# EAGLE design LampMatrixShield (EAGLE 7.2.0)
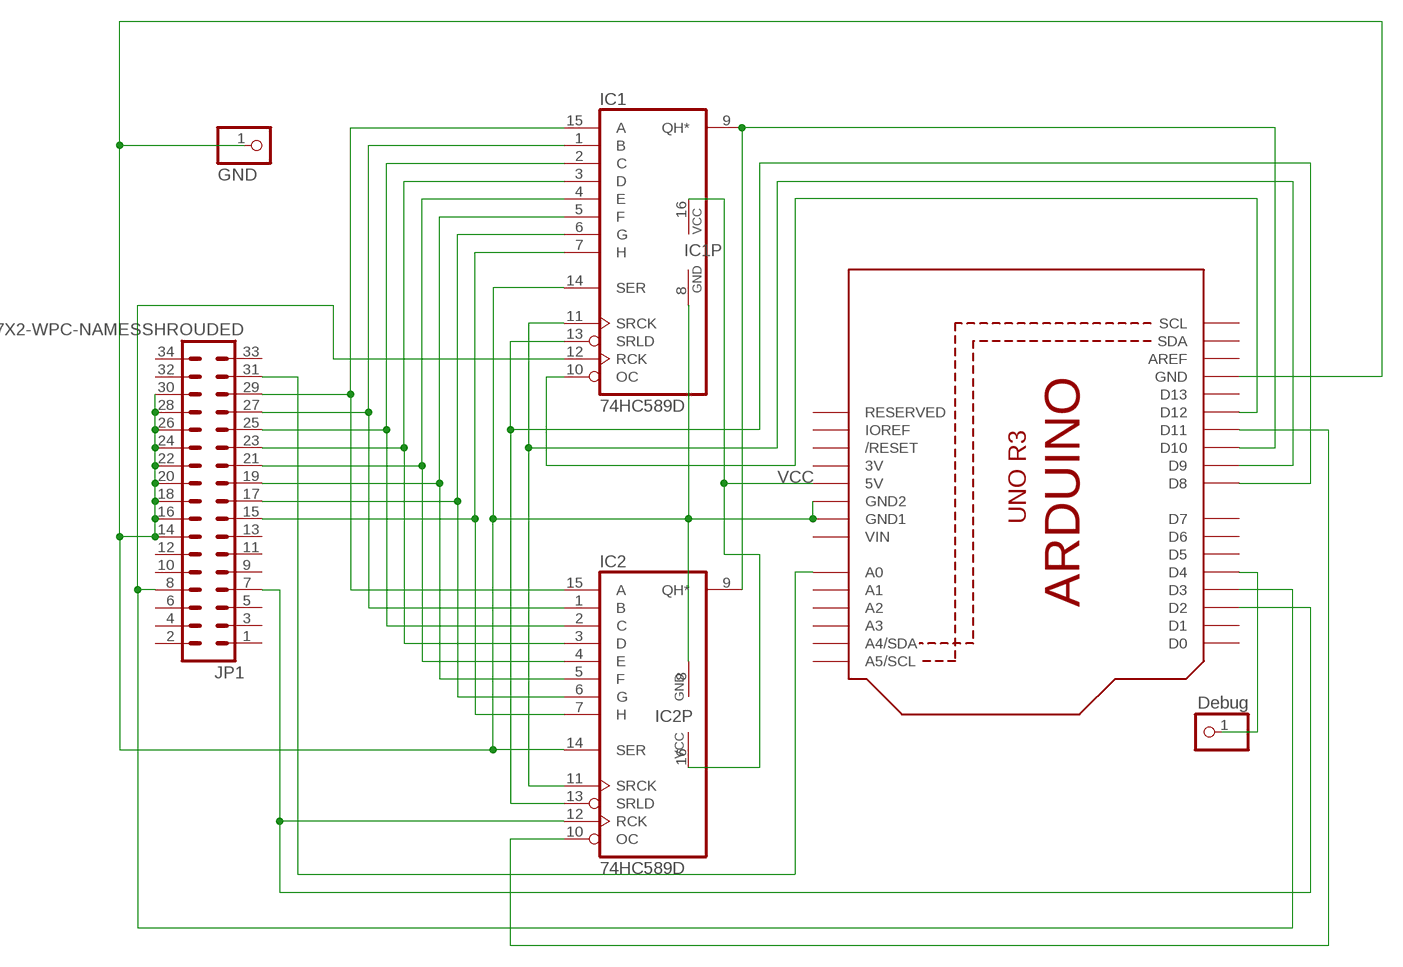
[diagram p0: schematic, sheet 1]

## Parts
IC1  74HC589D  [SO16]
IC2  74HC589D  [SO16]
JP1  M17X2-WPC-NAMESSHROUDED  [2X17_SHROUDED]
JP2  GND  PINHD-1X1CB  [1X01-CLEANBIG]
JP3  Debug  PINHD-1X1CB  [1X01-CLEANBIG]
U1  ARDUINOR3-BPLACE  [ARDUINOR3-BPLACE]

## Nets
GND: IC1.8(GND) IC1.14(SER) IC2.8(GND) IC2.14(SER) JP1.14 JP1.16 JP1.18 JP1.20 JP1.22 JP1.24 JP1.26 JP1.28 JP1.30 JP2.1 U1.GND U1.GND1 U1.GND2
N$1: IC1.15(A) IC2.15(A) JP1.29
N$2: IC1.1(B) IC2.1(B) JP1.27
N$3: IC1.2(C) IC2.2(C) JP1.25
N$4: IC1.3(D) IC2.3(D) JP1.23
N$5: IC1.4(E) IC2.4(E) JP1.21
N$6: IC1.5(F) IC2.5(F) JP1.19
N$7: IC1.6(G) IC2.6(G) JP1.17
N$8: IC1.7(H) IC2.7(H) JP1.15
N$9: IC2.12(RCK) JP1.7 U1.D2
N$10: IC1.12(RCK) JP1.8 U1.D3
N$11: JP1.31 U1.A0
N$12: IC2.10(OC) U1.D11
N$13: IC1.10(OC) U1.D12
N$14: IC1.13(SRLD) IC2.13(SRLD) U1.D8
N$15: IC1.11(SRCK) IC2.11(SRCK) U1.D9
N$16: JP3.1 U1.D4
N$25: IC1.9(QH*) IC2.9(QH*) U1.D10
VCC: IC1.16(VCC) IC2.16(VCC) U1.5V
Unconnected: JP1.1 JP1.2 JP1.3 JP1.4 JP1.5 JP1.6 JP1.9 JP1.10 JP1.11 JP1.12 JP1.13 JP1.32 JP1.33 JP1.34 U1.A1 U1.A2 U1.A3 U1.A4(A4/SDA) U1.A5(A5/SCL) U1.AREF U1.D0 U1.D1 U1.D5 U1.D6 U1.D7 U1.D13 U1.IOREF U1.RESERVED U1.RESET(/RESET) U1.SCL U1.SDA

## Power pins joined to a net without a drawn wire
3V: U1.3V
VIN: U1.VIN

## Library data of the parts
IC1 IC2 = EricGu:74*589: 8-bit SHIFT REGISTER, input latch, 3-state
JP1 = EricGu:M17X2-WPC-NAMES: 0.1" spaced headers; PROD_ID: CONN-12263
JP2 JP3 = adafruit:PINHD-1X1: Pin header 1x1 for 0.1" spacing With round pins
U1 = adafruit:ARDUINOR3: This is a new object for the new Arduino R3 - with extra pins that you may want to use (such as IOref, and duplicated A4/A5

## Board
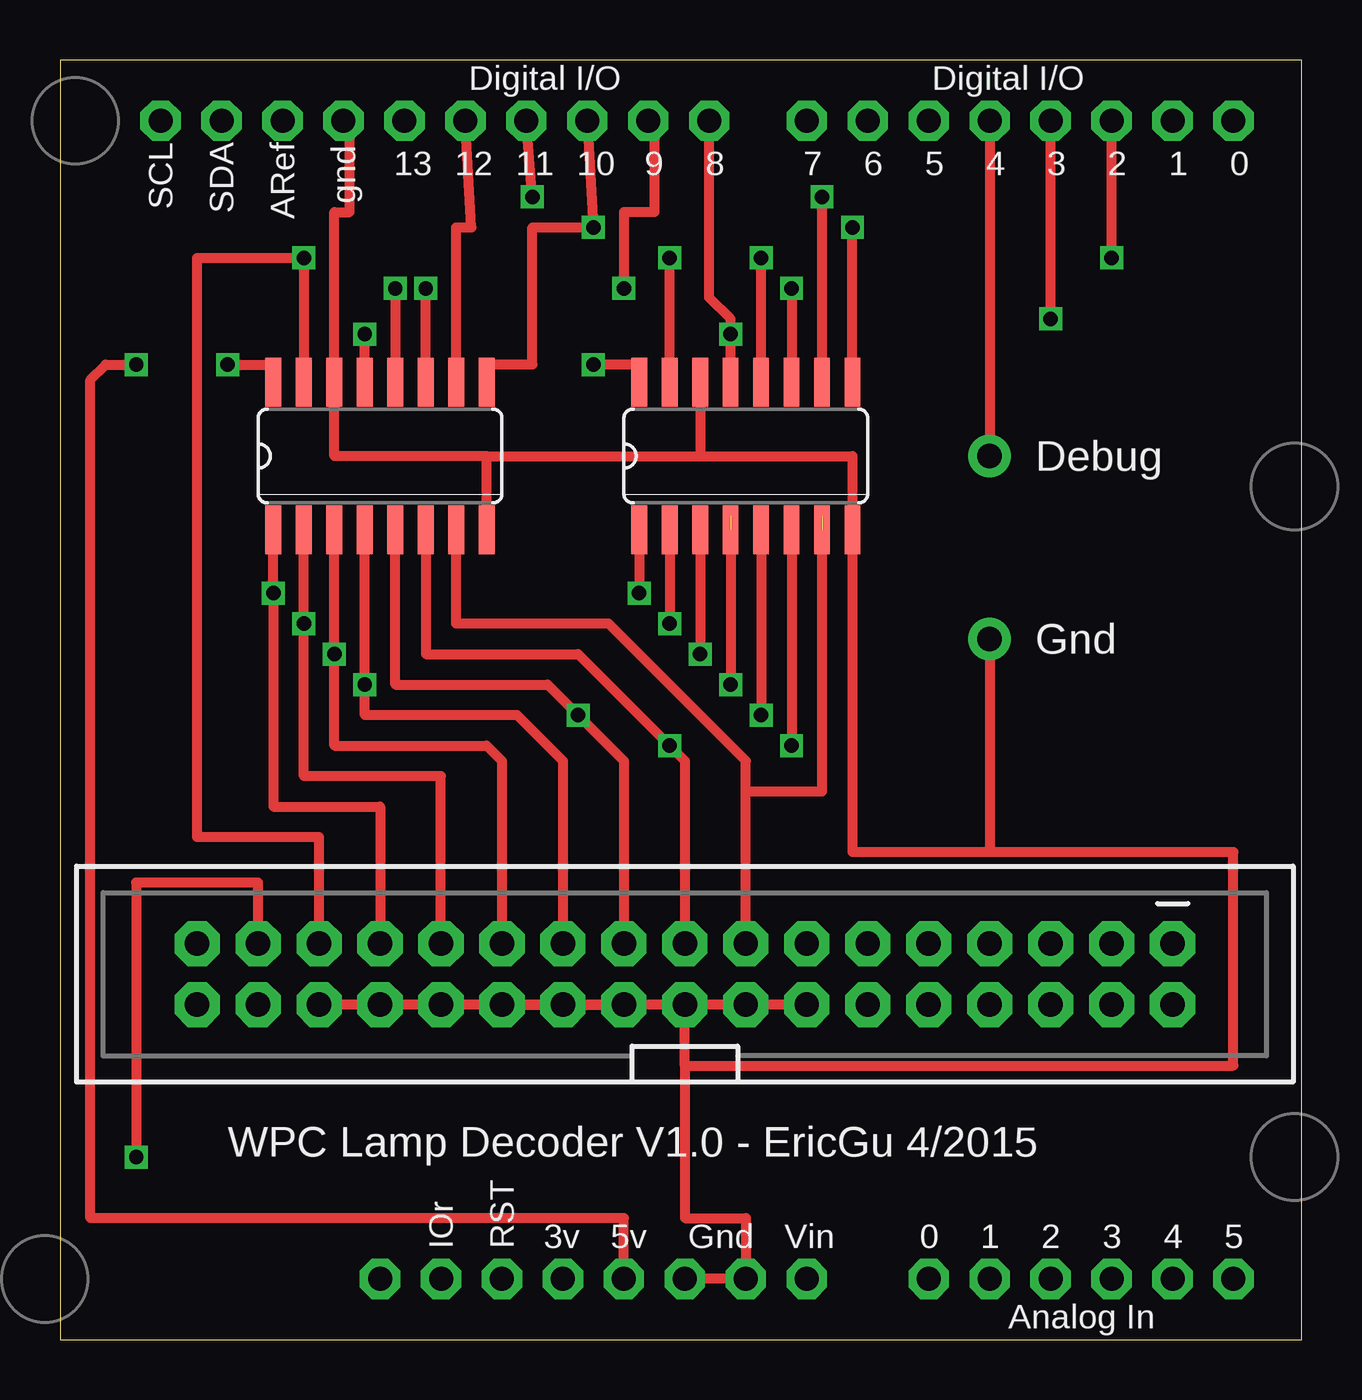
[diagram p1: board, top side]
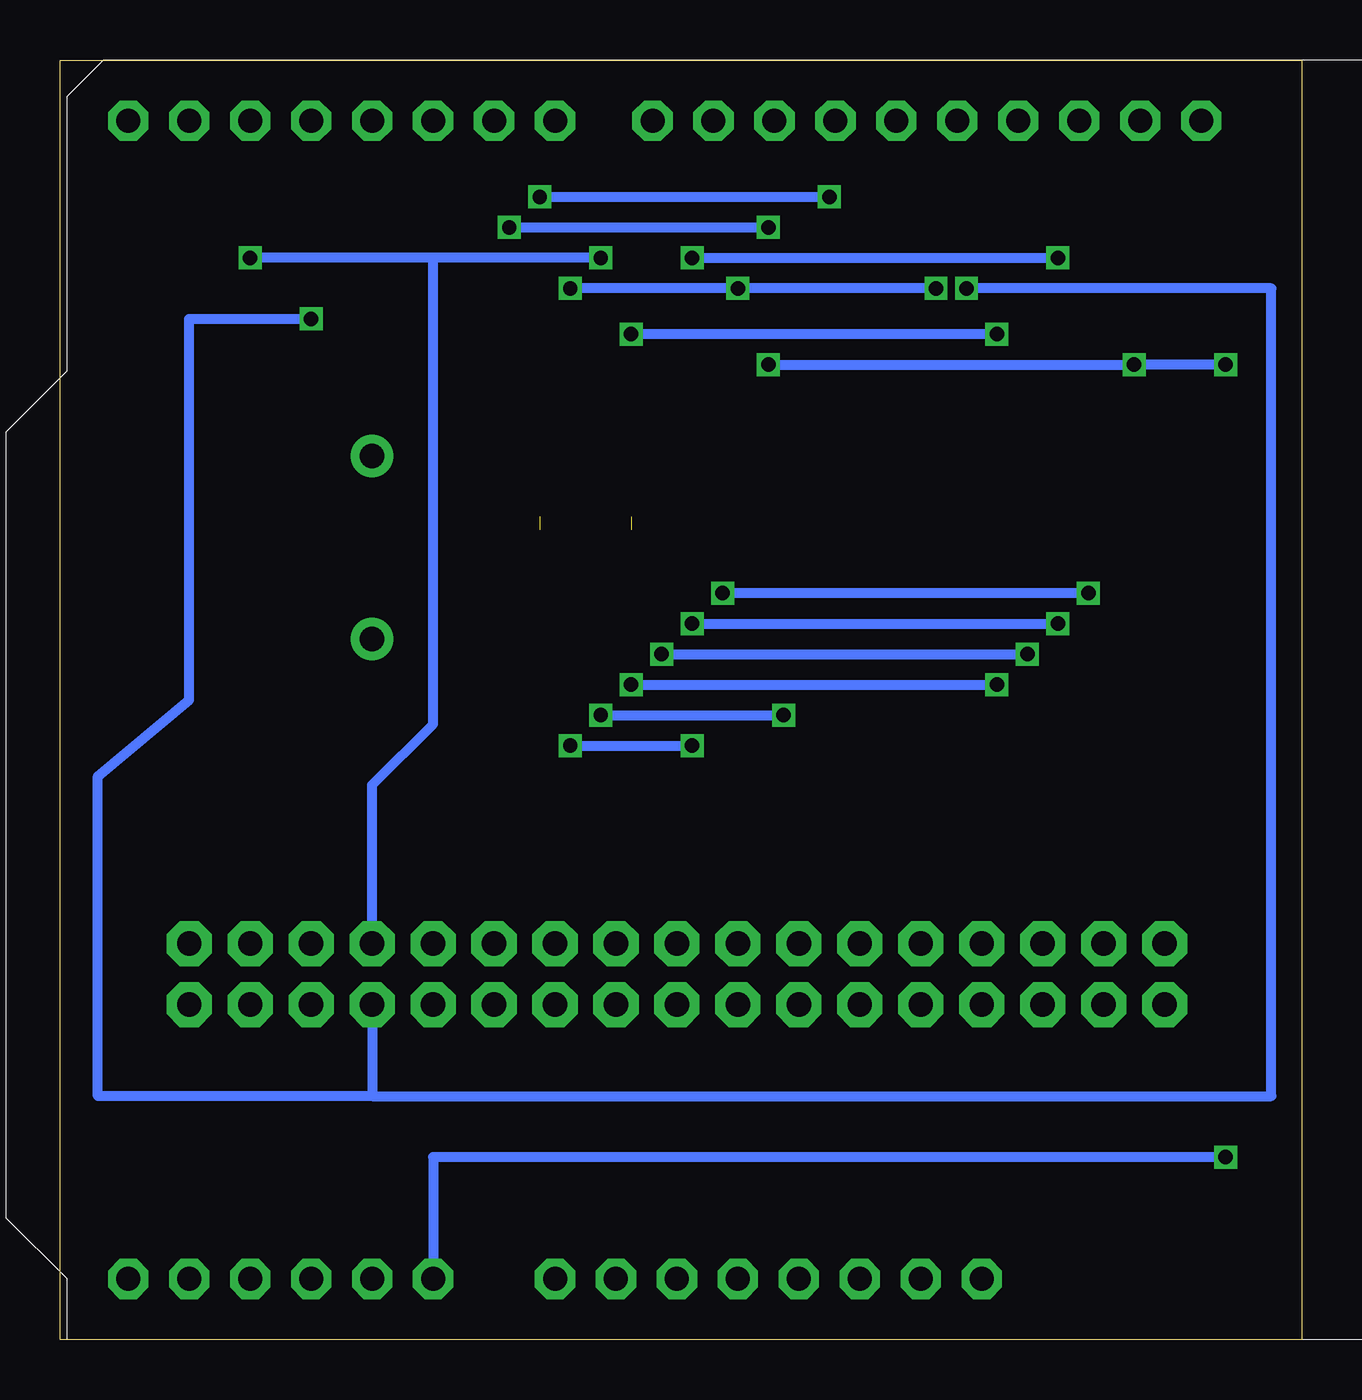
[diagram p2: board, bottom side, seen from below]

Size 51.74 x 53.33 mm. Coordinates in mm from the lower left corner, seen from the top.
Outline: 0,0 51.74,0 51.74,53.33 0,53.33 0,0
Copper layers (1*16): Top 0.0356mm / dielectric 1.5011mm / Bottom 0.0356mm
Design rules "LaenPCBOrder": minimum track width 6mil, minimum drill 13mil, track to track 6mil, track to pad 6mil, pad to pad 6mil, via to via 6mil, smd to smd 6mil, copper to edge 15mil, drill to drill 6mil, minimum pad ring 7mil, minimum via ring 7mil, stop-mask expansion 3mil, vias tented up to drill 0mil, thermal gap 10mil

### Footprints (pad centres in the part's own frame; a part is rotated, then mirrored left to right if it is on the bottom)
SO16 = smd 0.66 x 2.032: 1 -4.445,-3.073; 2 -3.175,-3.073; 3 -1.905,-3.073; 4 -0.635,-3.073; 5 0.635,-3.073; 6 1.905,-3.073; 7 3.175,-3.073; 8 4.445,-3.073; 9 4.445,3.073; 10 3.175,3.073; 11 1.905,3.073; 12 0.635,3.073; 13 -0.635,3.073; 14 -1.905,3.073; 15 -3.175,3.073; 16 -4.445,3.073
2X17_SHROUDED = drill 1.016 pad 1.88 octagon: 1 1.27,-20.32; 2 -1.27,-20.32; 3 1.27,-17.78; 4 -1.27,-17.78; 5 1.27,-15.24; 6 -1.27,-15.24; 7 1.27,-12.7; 8 -1.27,-12.7; 9 1.27,-10.16; 10 -1.27,-10.16; 11 1.27,-7.62; 12 -1.27,-7.62; 13 1.27,-5.08; 14 -1.27,-5.08; 15 1.27,-2.54; 16 -1.27,-2.54; 17 1.27,0; 18 -1.27,0; 19 1.27,2.54; 20 -1.27,2.54; 21 1.27,5.08; 22 -1.27,5.08; 23 1.27,7.62; 24 -1.27,7.62; 25 1.27,10.16; 26 -1.27,10.16; 27 1.27,12.7; 28 -1.27,12.7; 29 1.27,15.24; 30 -1.27,15.24; 31 1.27,17.78; 32 -1.27,17.78; 33 1.27,20.32; 34 -1.27,20.32
1X01-CLEANBIG = drill 1.016 pad 1.778: 1 0,0
ARDUINOR3-BPLACE = drill 1 pad 1.676 octagon: 3V 35.56,2.54; 5V 38.1,2.54; A0 50.8,2.54; A1 53.34,2.54; A2 55.88,2.54; A3 58.42,2.54; A4 60.96,2.54; A5 63.5,2.54; AREF 23.876,50.8; D0 63.5,50.8; D1 60.96,50.8; D2 58.42,50.8; D3 55.88,50.8; D4 53.34,50.8; D5 50.8,50.8; D6 48.26,50.8; D7 45.72,50.8; D8 41.656,50.8; D9 39.116,50.8; D10 36.576,50.8; D11 34.036,50.8; D12 31.496,50.8; D13 28.956,50.8; GND 26.416,50.8; GND1 43.18,2.54; GND2 40.64,2.54; IOREF 30.48,2.54; RESERVED 27.94,2.54; RESET 33.02,2.54; SCL 18.796,50.8; SDA 21.336,50.8; VIN 45.72,2.54

### Placement (x,y rotation side)
IC1  13.33,36.83 0 top
IC2  28.57,36.83 0 top
JP1  26.04,15.24 90 top
JP2  38.73,29.21 180 top
JP3  38.73,36.83 0 top
U1  -14.61,0 0 top

### Tracks (layer width: path | path; a pad name or v marks a point on that pad's centre or on a via)
GND
  Top 0.406: 26.67,40.64 IC2.14 26.67,36.83 | 26.04,11.43 26.04,5.08 28.57,5.08 U1.GND1 U1.GND2 | 26.04,11.43 48.89,11.43 48.89,20.32 38.73,20.32 | 38.73,20.32 33.02,20.32 IC2.8 33.02,36.83 26.67,36.83 | JP1.14 JP1.16 JP1.18 | JP1.18 JP1.20 | 17.78,13.97 JP1.20 | JP1.20 JP1.22 JP1.24 JP1.26 JP1.28 JP1.30 | JP2.1 38.73,20.32 | 26.04,11.43 JP1.18 | IC1.8 17.78,36.83 | 17.78,36.83 11.43,36.83 IC1.14 11.43,46.99 12.07,46.99 12.07,50.8 U1.GND | 17.78,36.83 26.67,36.83
N$1  (via drill 0.6)
  Top 0.406: JP1.29 10.79,20.95 5.71,20.95 5.71,45.09 v10.16,45.09 IC1.15 | IC2.15 v25.4,45.09
  Bottom 0.406: v25.4,45.09 v10.16,45.09
N$2  (via drill 0.6)
  Top 0.406: IC1.1 v8.89,31.12 8.89,22.23 13.33,22.23 JP1.27 | IC2.1 v24.13,31.12
  Bottom 0.406: v8.89,31.12 v24.13,31.12
N$3  (via drill 0.6)
  Top 0.406: JP1.25 15.87,23.49 10.16,23.49 v10.16,29.84 IC1.2 | IC2.2 v25.4,29.84
  Bottom 0.406: v25.4,29.84 v10.16,29.84
N$4  (via drill 0.6)
  Top 0.406: IC1.3 v11.43,28.58 11.43,24.77 17.78,24.77 18.41,24.13 18.41,23.49 JP1.23 | IC2.3 v26.67,28.58
  Bottom 0.406: v26.67,28.58 v11.43,28.58
N$5  (via drill 0.6)  (1 unrouted)
  Top 0.406: IC1.4 v12.7,27.3 12.7,26.03 19.05,26.03 20.96,24.13 20.96,23.49 JP1.21 | 27.94,34.29 v27.94,27.3
  Bottom 0.406: v27.94,27.3 v12.7,27.3
N$6  (via drill 0.6)
  Top 0.406: IC1.5 13.97,27.3 20.32,27.3 v21.59,26.03 23.5,24.13 JP1.19 | IC2.5 v29.21,26.03
  Bottom 0.406: v29.21,26.03 v21.59,26.03
N$7  (via drill 0.6)
  Top 0.406: IC2.6 v30.48,24.77 | IC1.6 15.24,28.58 21.59,28.58 v25.4,24.77 26.04,24.13 JP1.17
  Bottom 0.406: v30.48,24.77 v25.4,24.77
N$8  (1 unrouted)
  Top 0.406: JP1.15 28.57,22.86 | 28.57,22.86 28.57,24.13 22.86,29.84 16.51,29.84 IC1.7 | 28.57,22.86 31.75,22.86 31.75,34.29
N$9  (via drill 0.6)
  Top 0.406: v43.81,45.09 U1.D2 | IC2.12 v29.21,45.09
  Bottom 0.406: v29.21,45.09 36.19,45.09 | 36.19,45.09 v43.81,45.09 | JP1.7 38.73,23.12 36.19,25.66 36.19,45.09
N$10  (via drill 0.6)
  Top 0.406: v41.27,42.55 U1.D3 | v13.97,43.82 IC1.12
  Bottom 0.406: JP1.8 38.73,10.16 | 38.73,10.16 1.27,10.16 1.27,43.82 v13.97,43.82 | 38.73,10.16 50.16,10.16 50.16,23.49 46.35,26.67 46.35,42.55 v41.27,42.55
N$11  (via drill 0.6)
  Top 0.406: JP1.31 8.25,19.05 3.18,19.05 v3.18,7.62
  Bottom 0.406: v3.18,7.62 36.19,7.62 U1.A0
N$12  (via drill 0.6)
  Top 0.406: IC2.10 v31.75,47.62 | v19.68,47.62 U1.D11
  Bottom 0.406: v31.75,47.62 v19.68,47.62
N$13
  Top 0.406: IC1.10 16.51,46.36 17.14,46.36 U1.D12
N$14  (via drill 0.6)
  Top 0.406: IC2.13 v27.94,41.91 27.94,42.55 27.05,43.43 U1.D8 | IC1.13 v12.7,41.91
  Bottom 0.406: v12.7,41.91 v27.94,41.91
N$15  (via drill 0.6)
  Top 0.406: U1.D9 24.76,50.55 24.76,46.99 23.5,46.99 v23.5,43.82 | IC1.11 v15.24,43.82 | v30.48,43.82 IC2.11
  Bottom 0.406: v30.48,43.82 v23.5,43.82 v15.24,43.82
N$16
  Top 0.406: U1.D4 JP3.1
N$25  (via drill 0.6)
  Top 0.406: U1.D10 v22.22,46.36 19.68,46.36 19.68,40.64 17.78,40.64 IC1.9 | IC2.9 v33.02,46.36
  Bottom 0.406: v33.02,46.36 v22.22,46.36
VCC  (via drill 0.6)
  Top 0.406: U1.5V 23.5,5.08 1.27,5.08 1.27,40.01 1.9,40.64 v3.18,40.64 | v6.98,40.64 8.89,40.64 IC1.16 | v22.22,40.64 24.13,40.64 IC2.16
  Bottom 0.406: v22.22,40.64 v6.98,40.64 v3.18,40.64

### Text on the board
tPlace: Debug | Gnd | WPC Lamp Decoder V1.0 - EricGu 4/2015